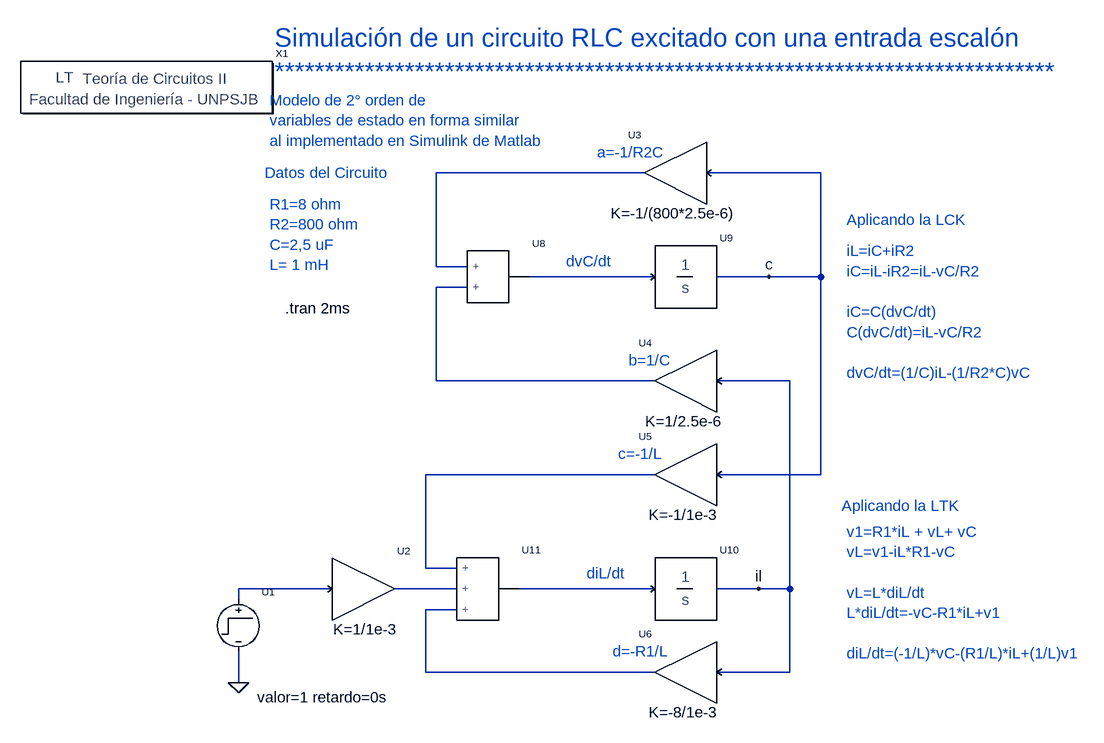
[diagram p0: schematic Simulación de un circuito de 2 orden RLC con entrada escalon a la Simulink.asc]
Simulación de un circuito de 2 orden RLC con entrada escalon a la Simulink.asc, the LTspice schematic file:
Version 4
SHEET 1 1228 752
WIRE 400 -416 80 -416
WIRE 672 -416 496 -416
WIRE 80 -272 80 -416
WIRE 128 -272 80 -272
WIRE 416 -256 224 -256
WIRE 592 -256 512 -256
WIRE 672 -256 672 -416
WIRE 672 -256 592 -256
WIRE 128 -240 80 -240
WIRE 80 -96 80 -240
WIRE 416 -96 80 -96
WIRE 624 -96 512 -96
WIRE 416 48 64 48
WIRE 672 48 672 -256
WIRE 672 48 512 48
WIRE 64 192 64 48
WIRE 112 192 64 192
WIRE -80 224 -224 224
WIRE 112 224 16 224
WIRE 416 224 208 224
WIRE 576 224 512 224
WIRE 624 224 624 -96
WIRE 624 224 576 224
WIRE -224 240 -224 224
WIRE 112 256 64 256
WIRE 64 352 64 256
WIRE 416 352 64 352
WIRE 624 352 624 224
WIRE 624 352 512 352
WIRE -224 368 -224 320
FLAG 592 -256 c
FLAG 576 224 il
FLAG -224 368 0
SYMBOL ganancia -32 224 R0
SYMATTR SpiceLine K=1/1e-3
SYMATTR InstName U2
SYMBOL ganancia 448 -416 M0
SYMATTR SpiceLine K=-1/(800*2.5e-6)
SYMATTR InstName U3
SYMBOL ganancia 464 -96 M0
SYMATTR SpiceLine K=1/2.5e-6
SYMATTR InstName U4
SYMBOL ganancia 464 48 M0
SYMATTR SpiceLine K=-1/1e-3
SYMATTR InstName U5
SYMBOL ganancia 464 352 M0
SYMATTR SpiceLine K=-8/1e-3
SYMATTR InstName U6
SYMBOL integrador 464 -256 R0
SYMATTR InstName U9
SYMBOL integrador 464 224 R0
SYMATTR InstName U10
SYMBOL sumador3 176 208 R0
SYMATTR InstName U11
SYMBOL sumador2 192 -256 R0
SYMATTR InstName U8
SYMBOL Circuitos2\\Letreros\\Teoría\ de\ Circuitos\ II -368 -544 R0
SYMATTR InstName X1
SYMBOL Circuitos2\\Fuentes\\Vescalon -224 288 R0
SYMATTR InstName U1
TEXT -176 -368 Left 2 ;R1=8 ohm\nR2=800 ohm\nC=2,5 uF\nL= 1 mH
TEXT -184 -416 Left 2 ;Datos del Circuito
TEXT -176 -528 Left 2 ;Modelo de 2° orden de\nvariables de estado en forma similar\nal implementado en Simulink de Matlab
TEXT -168 -624 Left 4 ;Simulación de un circuito RLC excitado con una entrada escalón\n******************************************************************************
TEXT -152 -208 Left 2 !.tran 2ms
TEXT 712 -296 Left 2 ;iL=iC+iR2\niC=iL-iR2=iL-vC/R2\n \niC=C(dvC/dt)\nC(dvC/dt)=iL-vC/R2\n \ndvC/dt=(1/C)iL-(1/R2*C)vC
TEXT 712 -344 Left 2 ;Aplicando la LCK
TEXT 704 96 Left 2 ;Aplicando la LTK
TEXT 712 136 Left 2 ;v1=R1*iL + vL+ vC\nvL=v1-iL*R1-vC\n \nvL=L*diL/dt\nL*diL/dt=-vC-R1*iL+v1\n \ndiL/dt=(-1/L)*vC-(R1/L)*iL+(1/L)v1
TEXT 328 -448 Left 2 ;a=-1/R2C
TEXT 376 -128 Left 2 ;b=1/C
TEXT 360 16 Left 2 ;c=-1/L
TEXT 352 320 Left 2 ;d=-R1/L
TEXT 312 200 Left 2 ;diL/dt
TEXT 280 -280 Left 2 ;dvC/dt

The netlist it stands for:
* Simulación de un circuito de 2 orden RLC con entrada escalon a la Simulink.asc
XU2 N005 N006 ganancia K=1/1e-3  ; pins en sal
XU3 c N001 ganancia K=-1/(800*2.5e-6)  ; pins en sal
XU4 il N003 ganancia K=1/2.5e-6  ; pins en sal
XU5 c N004 ganancia K=-1/1e-3  ; pins en sal
XU6 il N008 ganancia K=-8/1e-3  ; pins en sal
XU9 N002 c integrador  ; pins en sal
XU10 N007 il integrador  ; pins en sal
XU11 N004 N006 N008 N007 sumador3  ; pins + + + sal
XU8 N001 N003 N002 sumador2  ; pins + + sal
XX1 Teoría de Circuitos II
XU1 N005 0 FuenteEscalon valor=1 retardo=0s  ; pins 1 -
* R1=8 ohm
* R2=800 ohm
* C=2,5 uF
* L= 1 mH
* Datos del Circuito
* Modelo de 2° orden de
* variables de estado en forma similar
* al implementado en Simulink de Matlab
* Simulación de un circuito RLC excitado con una entrada escalón
* ******************************************************************************
.tran 2ms
* iL=iC+iR2
* iC=iL-iR2=iL-vC/R2
* iC=C(dvC/dt)
* C(dvC/dt)=iL-vC/R2
* dvC/dt=(1/C)iL-(1/R2*C)vC
* Aplicando la LCK
* Aplicando la LTK
* v1=R1*iL + vL+ vC
* vL=v1-iL*R1-vC
* vL=L*diL/dt
* L*diL/dt=-vC-R1*iL+v1
* diL/dt=(-1/L)*vC-(R1/L)*iL+(1/L)v1
* a=-1/R2C
* b=1/C
* c=-1/L
* d=-R1/L
* diL/dt
* dvC/dt
.lib ..\sym\Circuitos2\Bloques\Bloques.lib
.lib ..\sym\Circuitos2\Fuentes\Fuentes.lib
.backanno
.end